# Altium schematic sheet ActuatorMKII_Circuits.SchDoc: Circuits
size B; Date: 09/17/2022; Author: Dylan Trainor; CompanyName: UWRT; Organization: Ohio State University; Address1: ADDRESS 1; Address2: ADDRESS 2; Address3: ADDRESS 3; Address4: ADDRESS 4; DocumentNumber: 2; Revision: -; SheetNumber: 6; SheetTotal: 8; ENG_APP_DATE: --/--/--; DSN_APP_DATE: --/--/--; CHK_APP_DATE: --/--/--
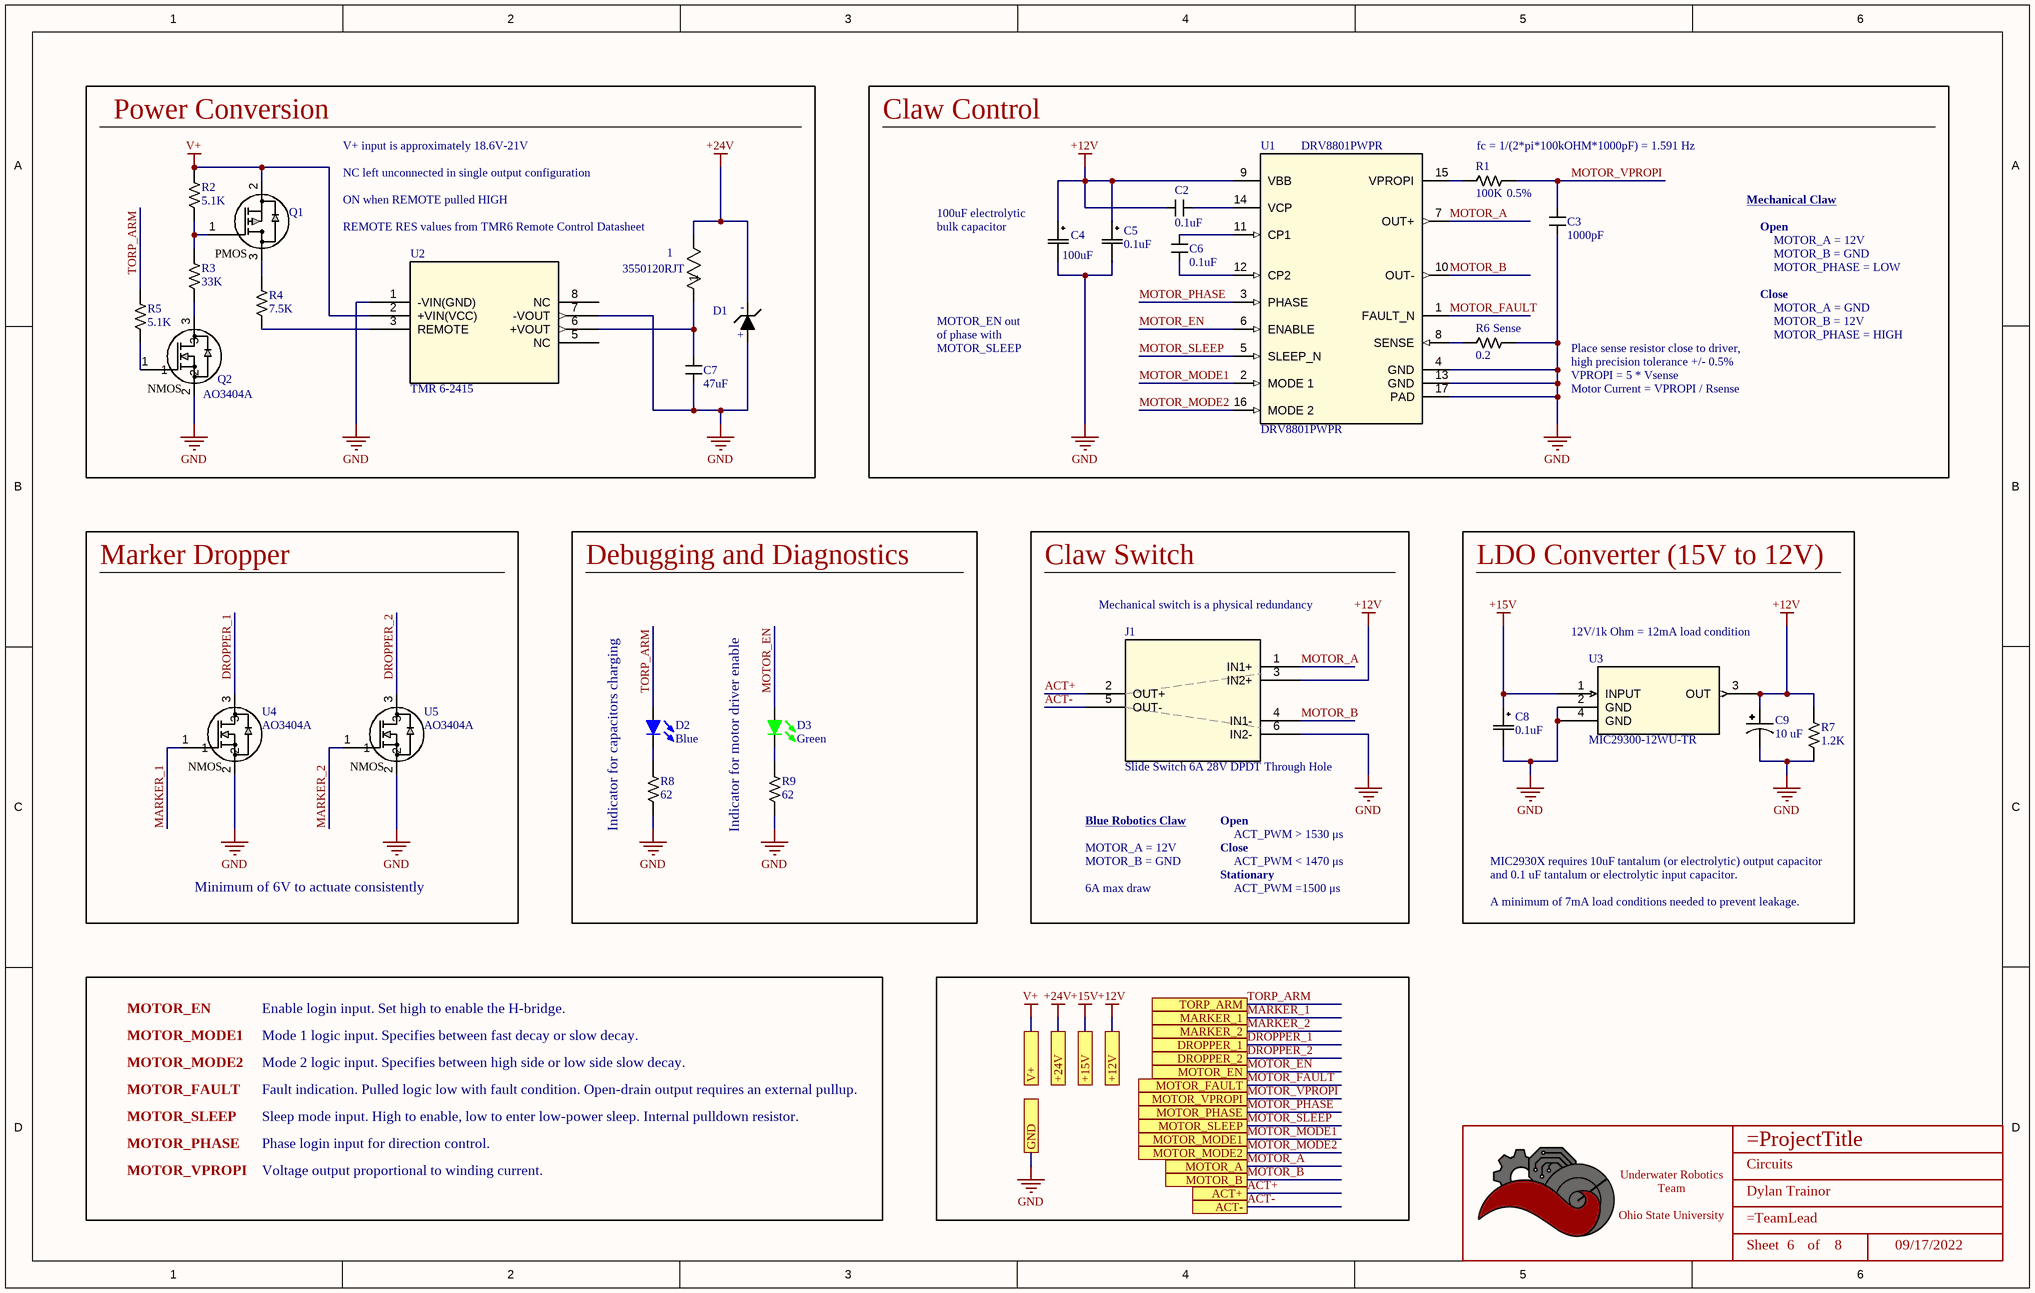
[diagram p0: ActuatorMKII_Circuits.SchDoc]

## Parts
1  3550120RJT  [RES_3550_TEC]
*  Title_Block  [LOGO]  (value not drawn)  (graphical)
C2  value 0.1uF  [CAPACITOR_0805]  (hidden comment: 100nF Ceramic 50V)
C3  value 1000pF  [CAPACITOR_0603]  (hidden comment: 1000pF Ceramic 50V)
C4  100uF  [CAPAE830X1100N]
C5  value 0.1uF  [U2-D_NCH]  (hidden comment: 0.1uF electrolytic 35 V)
C6  value 0.1uF  [CAPACITOR_0805]  (hidden comment: 100nF Ceramic 50V)
C7  value 47uF  [PCAP_8x5.4-ELECT_NCA]  (hidden comment: 47uF Electrolytic 50V)
C8  value 0.1uF  [U2-D_NCH]  (hidden comment: 0.1uF electrolytic 35 V)
C9  Value (uF): 10 uF  [CAPACITOR_1206 - POLAR]  (hidden comment: 10uF Tantalum 16V)
D1  Zener_Diode_10V_410mW  [SOD-123]  (value not drawn)
D2  Color: Blue  [LED_0603]  (hidden comment: 150060BS75000)
D3  Color: Green  [LED_0603]  (hidden comment: IN-S63AT5G)
J1  Slide Switch 6A 28V DPDT Through Hole  [CONN_S3CQE2]
Q1  DMP3056L-7  [SOT-23-3]  (value not drawn)
Q2  AO3404A  [SOT-23-3]
R1  Value  (Ohms): 100K  [RESISTOR_0603]  (hidden comment: 100k Ohm 5% 1/8W)
R2  Value  (Ohms): 5.1K  [RESISTOR_0805]  (hidden comment: 5.1k Ohm 1% 1/8W)
R3  Value  (Ohms): 33K  [RESISTOR_0805]  (hidden comment: 33k Ohm 5% 1/8W)
R4  Value  (Ohms): 7.5K  [RESISTOR_0603]  (hidden comment: 7.5k Ohm 5% 1/10W)
R5  Value  (Ohms): 5.1K  [RESISTOR_0805]  (hidden comment: 5.1k Ohm 1% 1/8W)
R6  Value  (Ohms): 0.2  [RESISTOR_2512]  (hidden comment: 0.2 Ohm 1% 2W 2512)
R7  Value  (Ohms): 1.2K  [RESISTOR_0805]  (hidden comment: 1.2k Ohm 5% 1/2W)
R8  Value  (Ohms): 62  [RESISTOR_0603]  (hidden comment: 62 Ohm 1% 1/4W)
R9  Value  (Ohms): 62  [RESISTOR_0603]  (hidden comment: 62 Ohm 1% 1/4W)
U1  DRV8801PWPR  [PWP0016B]
U2  TMR 6-2415  [TMR 6_TRP]
U3  MIC29300-12WU-TR  [TO-263-3_MCH]
U4  AO3404A  [SOT-23-3]
U5  AO3404A  [SOT-23-3]

## Blocks framed on the sheet
Power Conversion: 1 C7 D1 Q1 Q2 R2-R5 U2
Claw Control: C2-C6 R1 R6 U1
Marker Dropper: U4 U5
Debugging and Diagnostics: D2 D3 R8 R9
Claw Switch: J1
LDO Converter (15V to 12V): C8 C9 R7 U3

## Ports
+12V, +15V, +24V, ACT+, ACT-, DROPPER_1, DROPPER_2, GND, MARKER_1, MARKER_2, MOTOR_A, MOTOR_B, MOTOR_EN, MOTOR_FAULT, MOTOR_MODE1, MOTOR_MODE2, MOTOR_PHASE, MOTOR_SLEEP, MOTOR_VPROPI, TORP_ARM, V+

## Nets
+12V: C2.2 C4.1 C5.1 C9.1 J1.3(IN2+) R7.1 U1.9(VBB) U3.3(OUT) ; port +12V
+15V: C8.1 U3.1(INPUT) ; port +15V
+24V: 1.2 D1.2 ; port +24V
GND: C3.2 C4.2 C5.2 C7.2 C8.2 C9.2 D1.1 J1.6(IN2-) Q2.2 R6.1 R7.2 R8.2 R9.2 U1.4(GND) U1.13(GND) U1.17(PAD) U2.1(-VIN(GND)) U2.7(-VOUT) U3.2(GND) U3.4(GND) U4.2 U5.2 ; port GND
V+: Q1.2 R2.1 U2.2(+VIN(VCC)) ; port V+
ACT+: J1.2(OUT+) ; port ACT+
ACT-: J1.5(OUT-) ; port ACT-
DROPPER_1: U4.3 ; port DROPPER_1
DROPPER_2: U5.3 ; port DROPPER_2
MARKER_1: U4.1 ; port MARKER_1
MARKER_2: U5.1 ; port MARKER_2
MOTOR_A: J1.1(IN1+) U1.7(OUT+) ; port MOTOR_A
MOTOR_B: J1.4(IN1-) U1.10(OUT-) ; port MOTOR_B
MOTOR_EN: D3.1 U1.6(ENABLE) ; port MOTOR_EN
MOTOR_FAULT: U1.1(FAULT_N) ; port MOTOR_FAULT
MOTOR_MODE1: U1.2(MODE_1) ; port MOTOR_MODE1
MOTOR_MODE2: U1.16(MODE_2) ; port MOTOR_MODE2
MOTOR_PHASE: U1.3(PHASE) ; port MOTOR_PHASE
MOTOR_SLEEP: U1.5(SLEEP_N) ; port MOTOR_SLEEP
MOTOR_VPROPI: C3.1 R1.1 ; port MOTOR_VPROPI
TORP_ARM: D2.1 R5.1 ; port TORP_ARM
Net1_1: 1.1 C7.1 U2.6(+VOUT)
NetC2_1: C2.1 U1.14(VCP)
NetC6_1: C6.1 U1.11(CP1)
NetC6_2: C6.2 U1.12(CP2)
NetD2_2: D2.2 R8.1
NetD3_2: D3.2 R9.1
NetQ1_1: Q1.1 R2.2 R3.1
NetQ1_3: Q1.3 R4.1
NetQ2_1: Q2.1 R5.2
NetQ2_3: Q2.3 R3.2
NetR1_2: R1.2 U1.15(VPROPI)
NetR4_2: R4.2 U2.3(REMOTE)
NetR6_2: R6.2 U1.8(SENSE)

Not connected (* = marked no-connect by the designer): U2 5(NC) 8(NC)

## Notes on the sheet
- V+ input is approximately 18.6V-21V
- (near U1) DRV8801PWPR
- (near R1) fc = 1/(2*pi*100kOHM*1000pF) = 1.591 Hz
- NC left unconnected in single output configuration
- ON when REMOTE pulled HIGH
- (near 1) REMOTE RES values from TMR6 Remote Control Datasheet
- (near C4) 100uF electrolytic
- (near C4) bulk capacitor
- (near R1) 0.5%
- Mechanical Claw
- Open
- Close
- MOTOR_A = 12V
- MOTOR_B = GND
- MOTOR_PHASE = LOW
- MOTOR_EN out
- of phase with
- MOTOR_SLEEP
- (near R6) Sense
- Place sense resistor close to driver,
- high precision tolerance +/- 0.5%
- MOTOR_A = GND
- MOTOR_B = 12V
- MOTOR_PHASE = HIGH
- VPROPI = 5 * Vsense
- Motor Current = VPROPI / Rsense
- Mechanical switch is a physical redundancy
- 12V/1k Ohm = 12mA load condition
- Indicator for capacitors charging
- Indicator for motor driver enable
- Blue Robotics Claw
- ACT_PWM > 1530 μs
- Minimum of 6V to actuate consistently
- 6A max draw
- Stationary
- ACT_PWM < 1470 μs
- ACT_PWM =1500 μs
- MIC2930X requires 10uF tantalum (or electrolytic) output capacitor
- and 0.1 uF tantalum or electrolytic input capacitor.
- A minimum of 7mA load conditions needed to prevent leakage.
- MOTOR_EN
- MOTOR_MODE1
- Enable login input. Set high to enable the H-bridge.
- Mode 1 logic input. Specifies between fast decay or slow decay.
- MOTOR_MODE2
- MOTOR_FAULT
- Mode 2 logic input. Specifies between high side or low side slow decay.
- Fault indication. Pulled logic low with fault condition. Open-drain output requires an external pullup.
- MOTOR_PHASE
- MOTOR_VPROPI
- Sleep mode input. High to enable, low to enter low-power sleep. Internal pulldown resistor.
- Phase login input for direction control.
- Voltage output proportional to winding current.
- DWG. NO.
- REV.
- SHT.
- THIS DOCUMENT AND THE DATA DISCLOSED HEREIN OR HEREWITH IS THE PROPERTY OF ALTIUM LIMITED AND MAY BE FREELY DISTRIBUTED IN WHOLE. NO RIGHTS ARE RESERVED OR EXPRESS OR IMPLIED WARANTEE GIVEN.
- REVISION
- DESCRIPTION
- DATE
- APPROVED
- ENG:
- APPROVALS
- PROJECT
- DSN:
- CHK:
- REFERENCE DOCUMENTS
- PROJECT REVISION:
- TITLE
- DOCUMENT REVISION:
- DESIGN ITEM:
- BOM:
- FAB DWG:
- PCB DWG:
- ASSY DWG:
- SCALE:
- SIZE
- B
- CAGE CODE
- FILE NAME
- DWG NO.
- SHEET
- OF
- REV
- (in symbol AO3404A) NMOS
- (in symbol DMP3056L-7) PMOS
- (in symbol Title_Block) Underwater Robotics Team / Ohio State University; Sheet; of
- (in symbol Zener_Diode_10V_410mW) -; +

## Library data of the parts
1 = 3550120RJT: RES 3550 120R 5%; Mfr_Name: TE Connectivity; Copyright: Copyright (C) 2022 Ultra Librarian. All rights reserved.; Manufacturer_Part_Number: 3550120RJT; RefDes: RefDes; Type: DEV; Supplier 1: RSComponents; Supplier Part Number 1: 1866355P
* = Title_Block: UWRT Schematic Title Block Template / Created June 2021, Dylan Trainor
C2 C6 = CAPACITOR_0.1uF_0402_1: Cap 100nF 50V +/-10% / Ceramic 0805; Voltage: 25V; Made By: Robert Pafford; Tolerance: +/- 10%; Supplier 1: Newark; Supplier Part Number 1: 38AH3645
C3 = CAPACITOR_0.001uF_0603: Cap 1000pF 50V +/-2% / Ceramic 0603; Voltage: 50; Made By: Flip B; ComponentLink1Description: Datsheet; ComponentLink1URL: https://datasheets.avx.com/C0GNP0-Dielectric.pdf; Tolerance: +/- 2%; Supplier 1: Arrow Electronics; Supplier Part Number 1: C0603C102K5RACTU
C4 = CAP ALUM 100UF 20% 35V SMD (2): Aluminum Electrolytic Capacitors - SMD 35V 100uF 0810 20%; Supplier 1: Mouser; Supplier Part Number 1: 581-AEA0810101M035R; Created By: John Ulm; V: 35V
C5 C8 = CAP ALUM 0.1UF 20% 35V SMD: 0.1 µF 35 V Aluminum Electrolytic Capacitors Radial, Can - SMD 7000 Hrs @ 105°C; Mfr_Name: Nichicon; Manufacturer_Part_Number: UCB1V0R1MCL1GS; Type: DEV; Made by: Tyson Nguyen; Copyright: Copyright (C) 2022 Ultra Librarian. All rights reserved.; RefDes: RefDes; Supplier 1: Digi-Key; Supplier Part Number 1: 493-9956-1-ND
C7 = CAP_ALUM_47uF: CAP ALUM 47uF 50V +/-20% / 8x5.4; Voltage: 6.3V; Made By: Flip B; ComponentLink1Description: Datsheet; ComponentLink1URL: https://www.mouser.com/datasheet/2/212/KEM_C1002_X7R_SMD-1102033.pdf; Tolerance: +/- 20%; Supplier 1: Digi-Key; Supplier Part Number 1: PCE3815CT-ND
C9 = CAPACITOR_10uF_1206_Tantalum_1: Cap 10uF 16V +/-20% / Tantalum 1206; Tolerance: +/- 10%; Made By: Dylan T; ComponentLink1Description: Digikey; ComponentLink1URL: https://www.digikey.com/en/products/detail/kyocera-avx/F981A106MMA/4004990; Voltage: 16V; Supplier 1: Newark; Supplier Part Number 1: 26AC4143
D1 = Zener_Diode_10V_410mW: Zener Diode | 10 V | 410 mW | SOD 123; Made By: Nathan A; Voltage - Zener: 10V; Power: 410mW; Package: SOD-123; Supplier 1: Digi-Key; Supplier Part Number 1: 3757-BZT52-C10_R1_00001CT-ND; ComponentLink1Description: Datasheet; ComponentLink1URL: https://www.panjit.com.tw/upload/datasheet/BZT52-C2V4_SERIES.pdf
D2 = LED_Blue_0603: LED Blue Vf= 3.2V If = 0.020A / 150060BS75000; Made By: Robert Pafford; Forward Current: 20mA; Forward Voltage: 3.2V; Package: 0603; Supplier 1: Digi-Key; Supplier Part Number 1: 732-4966-1-ND
D3 = LED_Green_0603_3V: LED Green Vf= 3V If = 0.005A / IN-S63AT5G; Made By: Robert Pafford; Forward Current: 5mA; ComponentLink1Description: Datasheet; ComponentLink1URL: https://www.we-online.de/katalog/datasheet/150060GS75000.pdf; Forward Voltage: 3V; Package: 0603; Supplier 1: Digi-Key; Supplier Part Number 1: 1830-1062-1-ND
J1 = Slide DPDT Switch: SWITCH SLIDE DPDT 6A 28V Through Hole; Mfr_Name: C&K; Manufacturer_Part_Number: 1201M2S3CQE2; Copyright: Copyright (C) 2022 Ultra Librarian. All rights reserved.; RefDes: RefDes; Type: DEV; Supplier 1: Newark; Supplier Part Number 1: 36AH1005
Q1 = DMP3056L-7: P-Channel 30V 4.3A (Ta) 1.38W (Ta) Surface Mount SOT23; Reviewed By: ---; VDSS (Max): -30V; Vgss (Max): +-25V; Id: -4.3A; Created By: John Ulm; Supplier 1: Digi-Key; Supplier Part Number 1: DMP3056L-7DICT-ND
Q2 U4 U5 = AO3404A: N-Channel 30 V 5.8A (Ta) 1.4W (Ta) Surface Mount SOT-23-3; Vendor: Alpha & Omega Semiconductor Inc.; SourceLibrary: ON_Semiconductor_2020-01-13; Vgs (Max): 3V @ 5.8A, 10V; Vgs (th): 3V @ 250µA; Vdss: 30V; Rds (on): 28mOhm @ 5.8A, 10V; Amp Rating: 5.8 A; FET Type: N-Channel; Package: SOT23-3L; Manufacturer _Part_Number: AO3404A; Power Dissipation: 1.4W (Ta); Supplier 1: Digi-Key; Supplier Part Number 1: 785-1004-1-ND; Created By: Dylan T
R1 = RESISTOR_100K_0603_1: RES 100k OHM 5% 1/10W 0603; Tolerance: +/- 5%; Made By: Flip B; ComponentLink1Description: Datasheet; ComponentLink1URL: https://www.bourns.com/docs/product-datasheets/CRxxxxx.pdf; Wattage: 1/10W; Supplier: Digikey; Digikey Part Numer: CR0603-JW-104ELFTR-ND; Supplier 1: Digi-Key; Supplier Part Number 1: CR0603-JW-104ELFCT-ND
R2 R5 = RESISTOR_5.1K_0805: RES 5.1k OHM 1% 1/8W 0805; Tolerance: +/- 5%; Made By: Dylan Trainor; ComponentLink1Description: Datasheet; ComponentLink1URL: https://www.bourns.com/docs/product-datasheets/CRxxxxx.pdf; Wattage: 1/8W; Supplier: Digikey; Digikey Part Numer: CR0603-JW-104ELFTR-ND; Supplier 1: Newark; Supplier Part Number 1: 53W4863
R3 = RESISTOR_33K_0805: RES 33k OHM 5% 1/8W 0805; Tolerance: +/- 5%; Made By: Dylan Trainor; ComponentLink1Description: Datasheet; ComponentLink1URL: https://www.bourns.com/docs/product-datasheets/CRxxxxx.pdf; Wattage: 1/8W; Supplier: Digikey; Digikey Part Numer: CR0603-JW-104ELFTR-ND; Supplier 1: Newark; Supplier Part Number 1: 65T8819
R4 = RESISTOR_7.5K_0603: RES 7.5k OHM 5% 1/10W 0603; Tolerance: +/- 5%; Wattage: 1/8W; Made By: Dylan Trainor; ComponentLink1Description: Datasheet; ComponentLink1URL: https://www.bourns.com/docs/product-datasheets/CRxxxxx.pdf; Supplier: Digikey; Digikey Part Numer: CR0603-JW-104ELFTR-ND; Supplier 1: Arrow Electronics; Supplier Part Number 1: CRCW06037K50JNEA
R6 = RESISTOR_0.2_1%_2512: RES 0.2 OHM 1% 2W 2512; Tolerance: +/- 1%; Made By: Dylan Trainor; ComponentLink1Description: Datasheet; ComponentLink1URL: https://www.bourns.com/docs/product-datasheets/CRxxxxx.pdf; Wattage: 2W; Supplier: Stackpole; Digikey Part Numer: CR0603-JW-104ELFTR-ND; Supplier 1: Avnet; Supplier Part Number 1: CSRN2512FKR200
R7 = RESISTOR_1.2K_0805: RES 1.2k OHM 5% 1/2W 0805; Tolerance: +/- 5%; Made By: Robert Pafford; Wattage: 1/2W; Supplier 1: Digi-Key; Supplier Part Number 1: P1.2KADCT-ND
R8 R9 = RESISTOR_62_0603: RES SMD 62 OHM 1% 1/4W 0603; Tolerance: +/- 1%; Made By: Robert Pafford; ComponentLink1Description: Datasheet; ComponentLink1URL: https://www.bourns.com/docs/product-datasheets/CRxxxxx.pdf; Wattage: 1/4W; Supplier: Digikey; Digikey Part Numer: CR0603-JW-104ELFTR-ND; Supplier 1: Digi-Key; Supplier Part Number 1: 541-RCS060362R0FKEACT-ND
U1 = DRV8801PWPR: Bipolar Motor Driver DMOS Parallel 16-HTSSOP; Mfr_Name: Texas Instruments; CompType: IC; Type: DEV; RefDes: RefDes; Copyright: Copyright (C) 2022 Ultra Librarian. All rights reserved.; Manufacturer_Part_Number: DRV8801PWPR; PartNumber: DRV8801PWP; PackageReference: PWP0016B; MountType: SMT; RoHS: Y; Manufacturer: Texas Instruments; Supplier 1: Digi-Key; Supplier Part Number 1: 296-25378-1-ND
U2 = TMR 6-2415: No Description Available; Mfr_Name: Traco Power; Copyright: Copyright (C) 2022 Ultra Librarian. All rights reserved.; Manufacturer_Part_Number: TMR 6-2415; RefDes: RefDes; Type: DEV; Supplier 1: Digi-Key; Supplier Part Number 1: 1951-1797-ND
U3 = MIC29300-12WU-TR: Linear Voltage Regulator IC Positive Fixed 1 Output 3A TO-263-3; Mfr_Name: Microchip; Copyright: Copyright (C) 2022 Ultra Librarian. All rights reserved.; Manufacturer_Part_Number: MIC29300-12WU-TR; RefDes: RefDes; Type: DEV; Supplier 1: Arrow Electronics; Supplier Part Number 1: MIC29300-12WU-TR